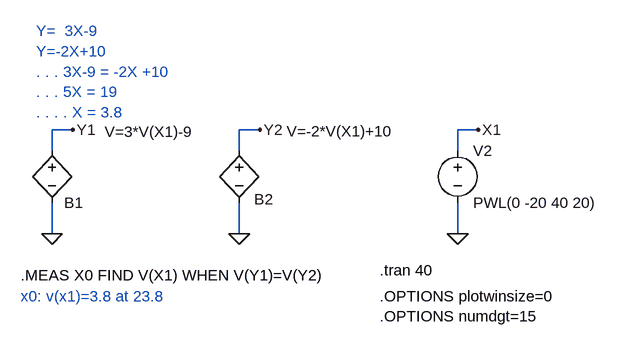
[diagram p0: schematic Fig_4-53_1st0rder-MEAS.asc]
Fig_4-53_1st0rder-MEAS.asc, the LTspice schematic file:
Version 4
SHEET 1 880 680
WIRE -48 80 -80 80
WIRE 240 80 208 80
WIRE 576 80 544 80
WIRE -80 112 -80 80
WIRE 208 112 208 80
WIRE 544 112 544 80
WIRE -80 240 -80 192
WIRE 208 240 208 192
WIRE 544 240 544 192
FLAG -80 240 0
FLAG -48 80 Y1
FLAG 208 240 0
FLAG 240 80 Y2
FLAG 544 240 0
FLAG 576 80 X1
SYMBOL bv -80 96 R0
WINDOW 0 19 96 Left 2
WINDOW 3 81 -13 Left 2
SYMATTR InstName B1
SYMATTR Value V=3*V(X1)-9
SYMBOL bv 208 96 R0
WINDOW 0 23 91 Left 2
WINDOW 3 73 -14 Left 2
SYMATTR InstName B2
SYMATTR Value V=-2*V(X1)+10
SYMBOL voltage 544 96 R0
WINDOW 123 0 0 Left 2
WINDOW 39 0 0 Left 2
SYMATTR InstName V2
SYMATTR Value PWL(0 -20 40 20)
TEXT 424 296 Left 2 !.tran 40
TEXT -128 304 Left 2 !.MEAS X0 FIND V(X1) WHEN V(Y1)=V(Y2)
TEXT 424 336 Left 2 !.OPTIONS plotwinsize=0\n.OPTIONS numdgt=15
TEXT -128 336 Left 2 ;x0: v(x1)=3.8 at 23.8
TEXT -104 -72 Left 2 ;Y=  3X-9\nY=-2X+10\n. . . 3X-9 = -2X +10\n. . . 5X = 19\n. . . . X = 3.8

The netlist it stands for:
* Fig_4-53_1st0rder-MEAS.asc
B1 Y1 0 V=3*V(X1)-9
B2 Y2 0 V=-2*V(X1)+10
V2 X1 0 PWL(0 -20 40 20)
.tran 40
.MEAS X0 FIND V(X1) WHEN V(Y1)=V(Y2)
.OPTIONS plotwinsize=0
.OPTIONS numdgt=15
* x0: v(x1)=3.8 at 23.8
* Y=  3X-9
* Y=-2X+10
* . . . 3X-9 = -2X +10
* . . . 5X = 19
* . . . . X = 3.8
.backanno
.end